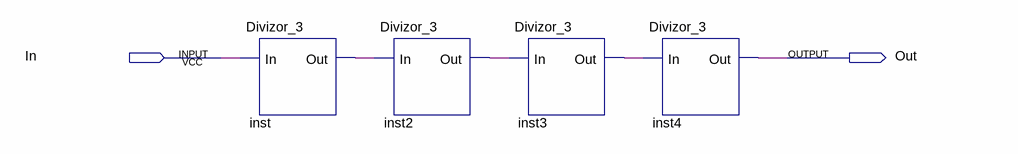
[diagram p0: schematic sheet]
// Quartus schematic Div_81.bdf as structural Verilog: 4 symbols, 2 pins
module Div_81 (
  input  In,
  output Out
);

  wire inst2_out, inst3_out, inst_out;

  Divizor_3 inst (.In(In), .Out(inst_out));
  Divizor_3 inst2 (.In(inst_out), .Out(inst2_out));
  Divizor_3 inst3 (.In(inst2_out), .Out(inst3_out));
  Divizor_3 inst4 (.In(inst3_out), .Out(Out));
endmodule
